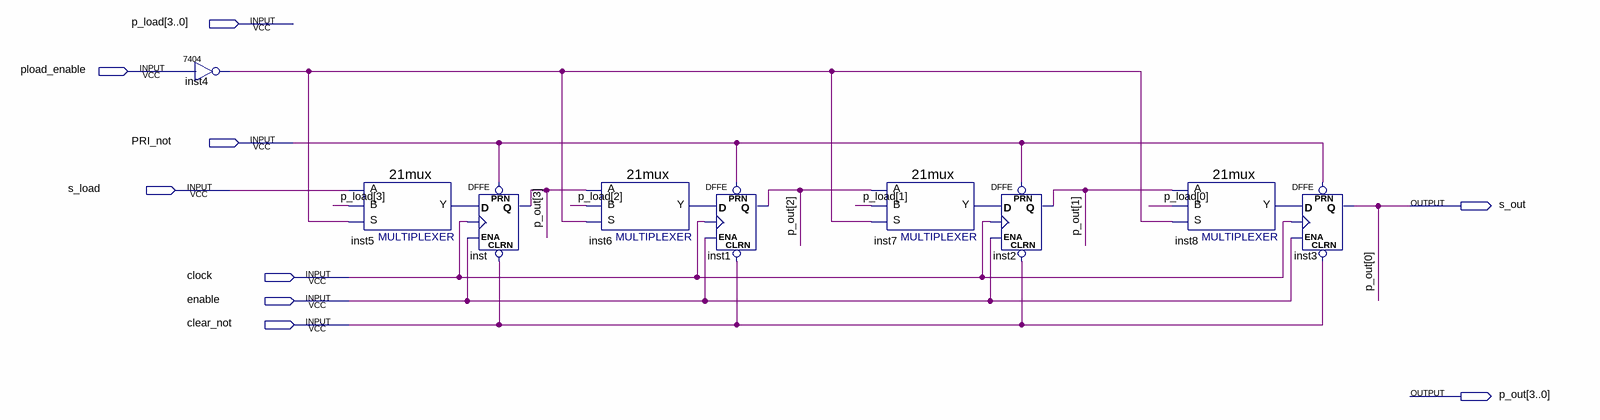
[diagram p0: schematic sheet]
// Quartus schematic shift_register_4bit.bdf as structural Verilog: 9 symbols, 9 pins
module shift_register_4bit (
  input  [3:0] p_load,
  input  pload_enable,
  input  PRI_not,
  input  s_load,
  input  clock,
  input  enable,
  input  clear_not,
  output s_out,
  output [3:0] p_out
);

  wire inst4_1, inst5_y, inst6_y, inst7_y, inst8_y;

  \7404  inst4 (.\2 (pload_enable), .\1 (inst4_1));
  \21mux  inst5 (.S(inst4_1), .B(p_load[3]), .A(s_load), .Y(inst5_y));
  DFFE inst (.PRN(PRI_not), .CLRN(clear_not), .D(inst5_y), .CLK(clock), .ENA(enable), .Q(p_out[3]));
  \21mux  inst6 (.S(inst4_1), .B(p_load[2]), .A(p_out[3]), .Y(inst6_y));
  DFFE inst1 (.PRN(PRI_not), .CLRN(clear_not), .D(inst6_y), .CLK(clock), .ENA(enable), .Q(p_out[2]));
  \21mux  inst7 (.S(inst4_1), .B(p_load[1]), .A(p_out[2]), .Y(inst7_y));
  DFFE inst2 (.PRN(PRI_not), .CLRN(clear_not), .D(inst7_y), .CLK(clock), .ENA(enable), .Q(p_out[1]));
  \21mux  inst8 (.S(inst4_1), .B(p_load[0]), .A(p_out[1]), .Y(inst8_y));
  DFFE inst3 (.PRN(PRI_not), .CLRN(clear_not), .D(inst8_y), .CLK(clock), .ENA(enable), .Q(p_out[0]));

  assign s_out = p_out[0];
endmodule
